# EAGLE design LightFlasher (EAGLE 6.1)
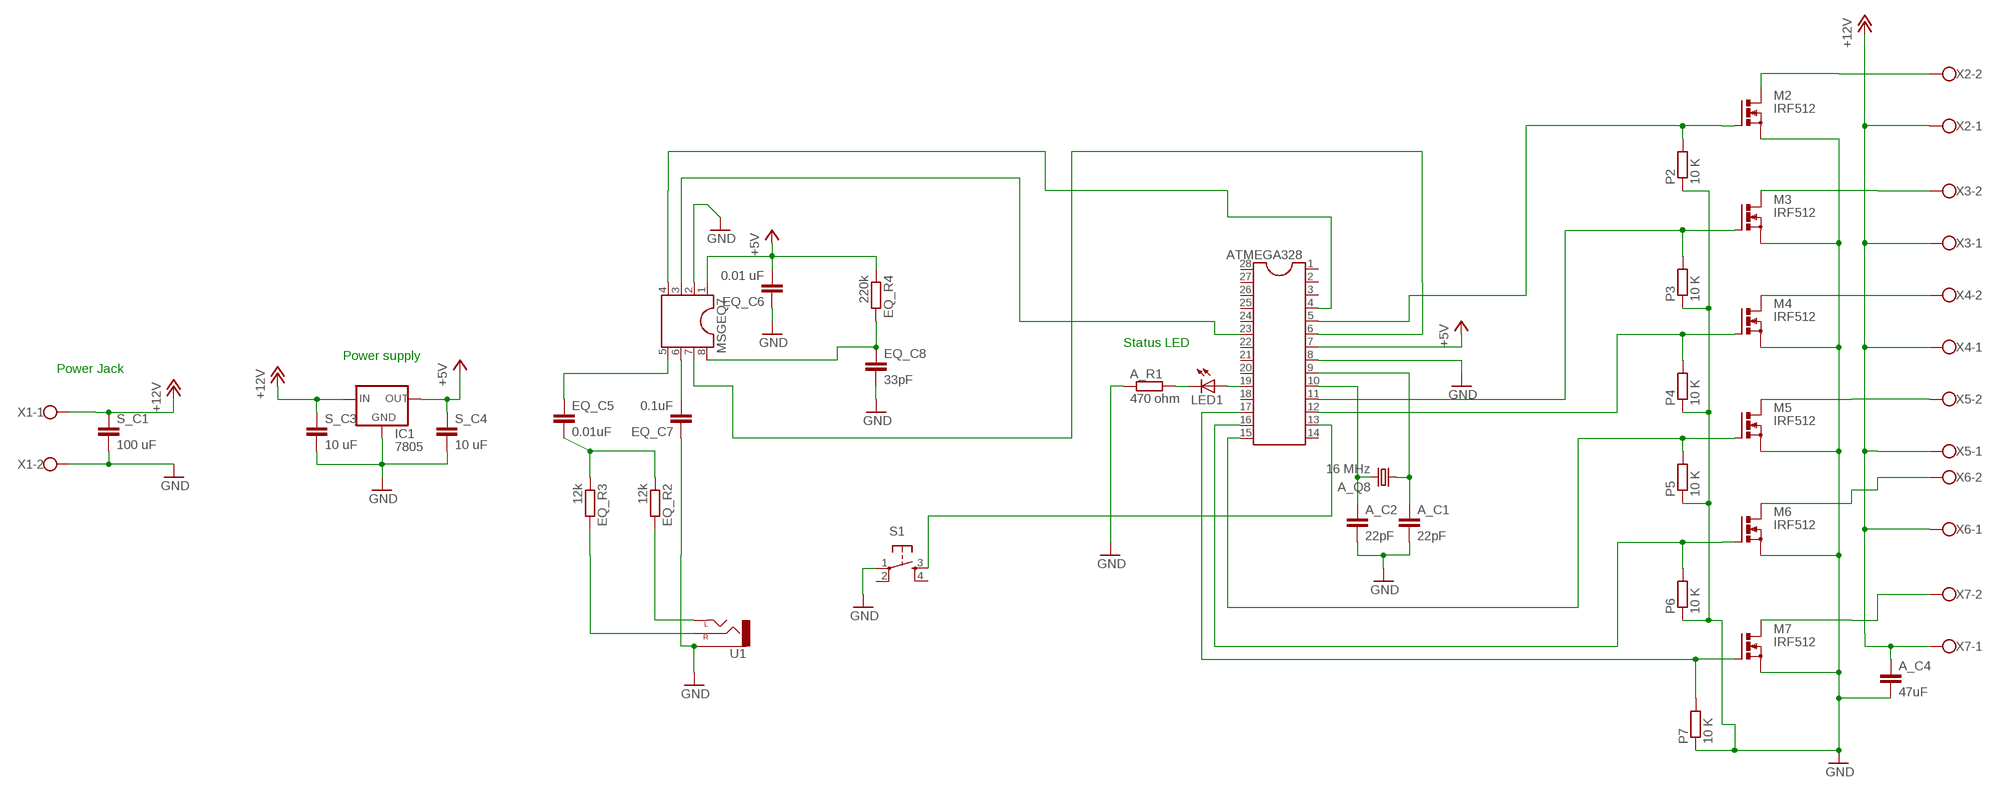
[diagram p0: schematic, sheet 1]

## Parts
A_C1  22pF  C-EU025-024X044  [C025-024X044]
A_C2  22pF  C-EU050-030X075  [C050-030X075]
A_C4  47uF  C-EU025-025X050  [C025-025X050]
A_Q8  16 MHz  CRYSTALHC49S  [HC49/S]
A_R1  470 ohm  R-EU_0204/5  [0204/5]
ATMEGA328  DIL28-3  [DIL28-3]
EQ_C5  0.01uF  C-EU025-024X044  [C025-024X044]
EQ_C6  0.01 uF  C-EU025-024X044  [C025-024X044]
EQ_C7  0.1uF  C-EU025-024X044  [C025-024X044]
EQ_C8  33pF  C-EU025-024X044  [C025-024X044]
EQ_R2  12k  R-EU_0204/5  [0204/5]
EQ_R3  12k  R-EU_0204/5  [0204/5]
EQ_R4  220k  R-EU_0204/5  [0204/5]
IC1  7805  78XXS  [78XXS]
LED1  LED3MM  [LED3MM]
M2  IRF512  [TO220BV]
M3  IRF512  [TO220BV]
M4  IRF512  [TO220BV]
M5  IRF512  [TO220BV]
M6  IRF512  [TO220BV]
M7  IRF512  [TO220BV]
MSGEQ7  DIL8S  [SOCKET-08]
P2  10 K  R-EU_0204/5  [0204/5]
P3  10 K  R-EU_0204/5  [0204/5]
P4  10 K  R-EU_0204/5  [0204/5]
P5  10 K  R-EU_0204/5  [0204/5]
P6  10 K  R-EU_0204/5  [0204/5]
P7  10 K  R-EU_0204/5  [0204/5]
S1  TAC_SWITCHPTH  [TACTILE-PTH]
S_C1  100 uF  C-EU050-025X075  [C050-025X075]
S_C3  10 uF  C-EU025-024X044  [C025-024X044]
S_C4  10 uF  C-EU025-024X044  [C025-024X044]
U1  AUDIO-JACKPTH  [AUDIO-JACK]
X1  W237-102  [W237-102]
X2  W237-102  [W237-102]
X3  W237-102  [W237-102]
X4  W237-102  [W237-102]
X5  W237-102  [W237-102]
X6  W237-102  [W237-102]
X7  W237-102  [W237-102]

## Nets
+5V: ATMEGA328.7 EQ_C6.2 EQ_R4.1 IC1.OUT MSGEQ7.1 S_C4.1
+12V: A_C4.1 IC1.IN S_C1.1 S_C3.1 X1.1 X2.1 X3.1 X4.1 X5.1 X6.1 X7.1
GND: A_C1.2 A_C2.2 A_C4.2 A_R1.1 ATMEGA328.8 EQ_C6.1 EQ_C7.1 EQ_C8.2 IC1.GND M2.S M3.S M4.S M5.S M6.S M7.S MSGEQ7.2 P2.1 P3.1 P4.1 P5.1 P6.1 P7.1 S1.1 S_C1.2 S_C3.2 S_C4.2 U1.SLEEVE X1.2
M6: M6.D X6.2
N$1: A_C2.1 A_Q8.2 ATMEGA328.10
N$2: A_C1.1 A_Q8.1 ATMEGA328.9
N$3: ATMEGA328.19 LED1.A
N$4: A_R1.2 LED1.K(C)
N$5: EQ_R2.2 U1.TIP(LEFT)
N$6: EQ_R3.2 U1.RING(RIGHT)
N$7: ATMEGA328.17 M7.G P7.2
N$8: EQ_C5.1 MSGEQ7.5
N$9: ATMEGA328.16 M6.G P6.2
N$10: ATMEGA328.4 MSGEQ7.4
N$11: EQ_C7.2 MSGEQ7.6
N$12: ATMEGA328.13 S1.3
N$13: EQ_C8.1 EQ_R4.2 MSGEQ7.8
N$14: ATMEGA328.23 MSGEQ7.3
N$15: ATMEGA328.5 M2.G P2.2
N$16: ATMEGA328.11 M3.G P3.2
N$17: ATMEGA328.12 M4.G P4.2
N$18: ATMEGA328.15 M5.G P5.2
N$20: M4.D X4.2
N$21: M2.D X2.2
N$22: M7.D X7.2
N$24: M5.D X5.2
N$26: M3.D X3.2
N$27: EQ_C5.2 EQ_R2.1 EQ_R3.1
N$28: ATMEGA328.6 MSGEQ7.7
Unconnected: ATMEGA328.1 ATMEGA328.2 ATMEGA328.3 ATMEGA328.14 ATMEGA328.18 ATMEGA328.20 ATMEGA328.21 ATMEGA328.22 ATMEGA328.24 ATMEGA328.25 ATMEGA328.26 ATMEGA328.27 ATMEGA328.28 S1.2 S1.4

## Notes on the sheet
- Status LED
- Power supply
- Power Jack

## Library data of the parts
A_C1 A_C2 A_C4 EQ_C5-EQ_C8 S_C1 S_C3 S_C4 = rcl:C-EU: CAPACITOR, European symbol
A_Q8 = crystal:CRYSTAL: CRYSTAL; OC_FARNELL: 1667008; OC_NEWARK: unknown
A_R1 EQ_R2-EQ_R4 P2-P7 = rcl:R-EU_: RESISTOR, European symbol
ATMEGA328 = ic-package:DIL28: Dual In Line
IC1 = v-reg:78XXS: VOLTAGE REGULATOR
LED1 = led:LED: LED OSRAM: - CHIPLED LG R971, LG N971, LY N971, LG Q971, LY Q971, LO R971, LY R971 LH N974, LH R974 LS Q976, LO Q976, LY Q976 LO Q996 - Hyper CHIPLED LW Q18S LB Q993, LB Q99A, LB R99A - SideLED LS A670, LO A670, LY A670, LG A670, LP A670 LB A673, LV A673, LT A673, LW A673 LH A674 LY A675 LS A676, LA A676, LO A676, LY A676, LW A676 LS A679, LY A679, LG A679 - Hyper Micro SIDELED® LS Y876, LA Y876, LO Y876, LY Y876 LT Y87S - SmartLED LW L88C, LW L88S LB L89C, LB L89S, LG L890 LS L89K, LO L89K, LY L89K LS L896, LA L896, LO L896, LY L896 - TOPLED LS T670, LO T670, LY T670, LG T670, LP T670 LSG T670, LSP T670, LSY T670, LOP T670, LYG T670 LG T671, LOG T671, LSG T671 LB T673, LV T673, LT T673, LW T673 LH T674 LS T676, LA T676, LO T676, LY T676, LB T676, LH T676, LSB T676, LW T676 LB T67C, LV T67C, LT T67C, LS T67K, LO T67K, LY T67K, LW E67C LS E67B, LA E67B, LO E67B, LY E67B, LB E67C, LV E67C, LT E67C LW T67C LS T679, LY T679, LG T679 LS T770, LO T770, LY T770, LG T770, LP T770 LB T773, LV T773, LT T773, LW T773 LH T774 LS E675, LA E675, LY E675, LS T675 LS T776, LA T776, LO T776, LY T776, LB T776 LHGB T686 LT T68C, LB T68C - Hyper Mini TOPLED® LB M676 - Mini TOPLED Santana® LG M470 LS M47K, LO M47K, LY M47K Source: http://www.osram.convergy.de LUXEON: - LUMILED® LXK2-PW12-R00, LXK2-PW12-S00, LXK2-PW14-U00, LXK2-PW14-V00 LXK2-PM12-R00, LXK2-PM12-S00, LXK2-PM14-U00 LXK2-PE12-Q00, LXK2-PE12-R00, LXK2-PE12-S00, LXK2-PE14-T00, LXK2-PE14-U00 LXK2-PB12-K00, LXK2-PB12-L00, LXK2-PB12-M00, LXK2-PB14-N00, LXK2-PB14-P00, LXK2-PB14-Q00 LXK2-PR12-L00, LXK2-PR12-M00, LXK2-PR14-Q00, LXK2-PR14-R00 LXK2-PD12-Q00, LXK2-PD12-R00, LXK2-PD12-S00 LXK2-PH12-R00, LXK2-PH12-S00 LXK2-PL12-P00, LXK2-PL12-Q00, LXK2-PL12-R00 Source: www.luxeon.com KINGBRIGHT: KA-3528ASYC Source: www.kingbright.com
M2-M7 = transistor-power:IRF512: N-CHANNEL MOS FET
MSGEQ7 = ic-package:DIL8: Dual In Line / Socket
S1 = SparkFun:TAC_SWITCH: Momentary Switch Button commonly used for reset or general input. Spark Fun Electronics SKU : COM-00097
U1 = SparkFun:AUDIO-JACK: 3.5mm Audio Jack Simple 3.5mm common PCB mount audio jack. SKU: PRT-08032
X1-X7 = con-wago-500:W237-102: WAGO SCREW CLAMP; MPN: 237-102; OC_FARNELL: unknown; OC_NEWARK: 70K9898

## Board
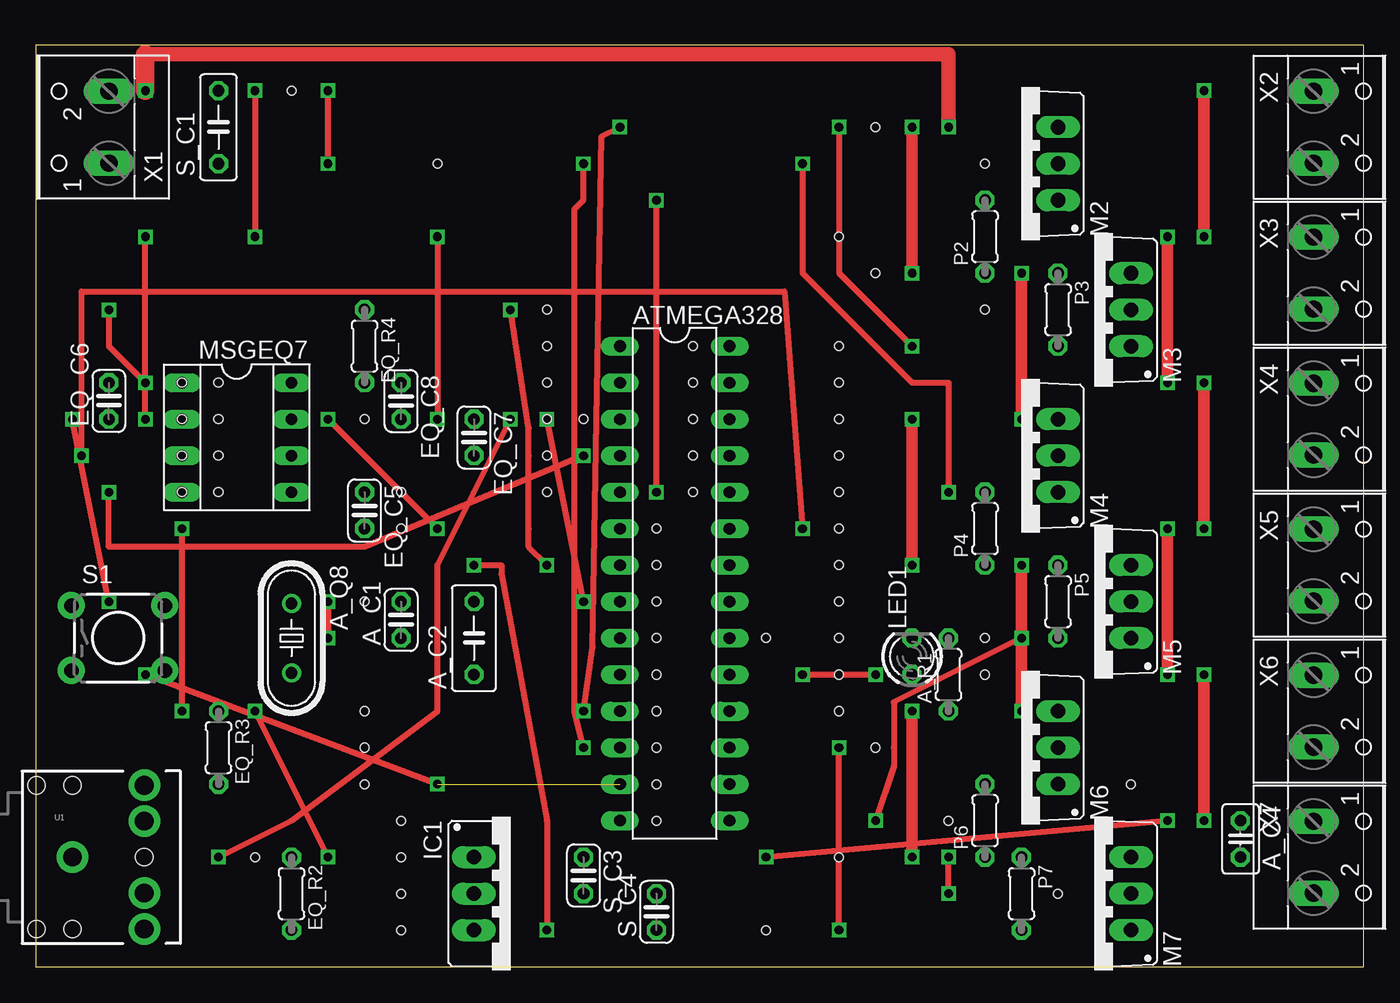
[diagram p1: board, top side]
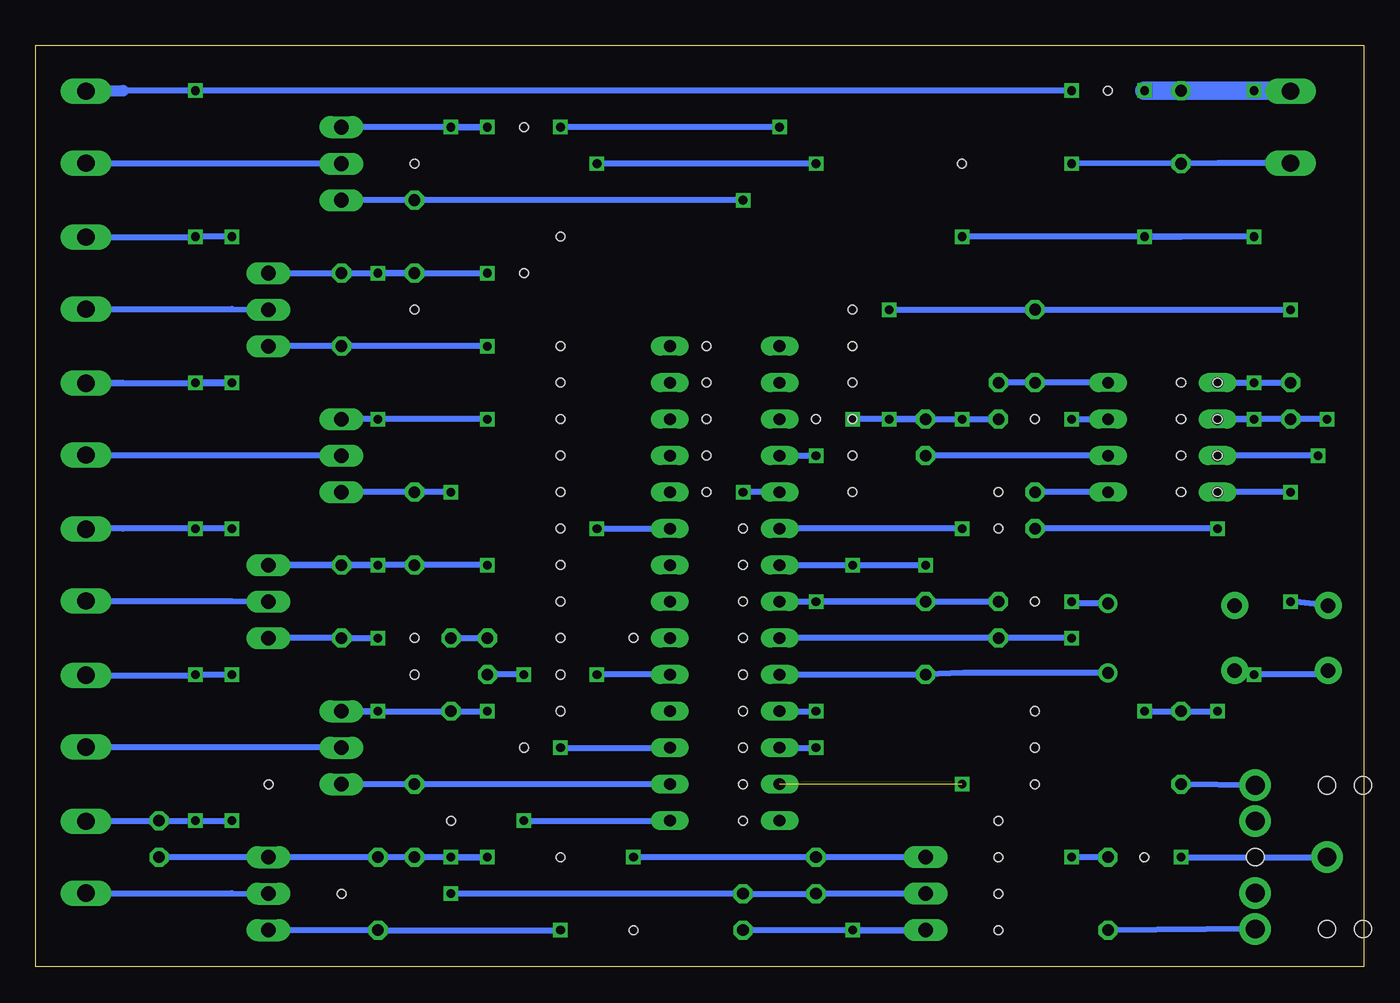
[diagram p2: board, bottom side, seen from below]

Size 92.38 x 64.12 mm. Coordinates in mm from the lower left corner, seen from the top.
Outline: 0,0 92.38,0 92.38,64.12 0,64.12 0,0
Copper layers (1*16): Top 0.035mm / dielectric 1.5mm / Bottom 0.035mm
Design rules: minimum track width 10mil, minimum drill 24mil, track to track 8mil, track to pad 8mil, pad to pad 8mil, via to via 8mil, smd to smd 8mil, copper to edge 40mil, drill to drill 8mil, minimum pad ring 10mil, minimum via ring 8mil, stop-mask expansion 4mil, vias tented up to drill 0mil, thermal gap 10mil
Holes 0.6 mm at 66.04,22.86 58.42,15.24 66.04,45.72 66.04,55.88 71.12,5.08 55.88,25.4 55.88,27.94 58.42,48.26 58.42,58.42 27.94,55.88 22.86,25.4 17.78,60.96 55.88,50.8 35.56,45.72 35.56,38.1 55.88,43.18 55.88,40.64 55.88,38.1 55.88,33.02 43.18,10.16 43.18,12.7 43.18,15.24 43.18,17.78 43.18,20.32 43.18,22.86 43.18,25.4 43.18,27.94 43.18,30.48 45.72,33.02 45.72,35.56 45.72,38.1 45.72,40.64 45.72,43.18 55.88,7.62 50.8,2.54 63.5,10.16 76.2,12.7 55.88,17.78 66.04,20.32 55.88,30.48 55.88,35.56 25.4,2.54 25.4,7.62 22.86,12.7 22.86,17.78 25.4,30.48 10.16,40.64 10.16,38.1 10.16,35.56 10.16,33.02 25.4,33.02 15.24,7.62 25.4,5.08 25.4,10.16 22.86,15.24 38.1,38.1 35.56,35.56 35.56,33.02 35.56,43.18 35.56,40.64 12.7,33.02 12.7,35.56 12.7,38.1 12.7,40.64 22.86,38.1 50.8,22.86 55.88,22.86 55.88,20.32

### Footprints (pad centres in the part's own frame; a part is rotated, then mirrored left to right if it is on the bottom)
C025-024X044 = drill 0.813 octagon: 1 -1.27,0; 2 1.27,0
C050-030X075 = drill 0.813 octagon: 1 -2.54,0; 2 2.54,0
C025-025X050 = drill 0.813 octagon: 1 -1.27,0; 2 1.27,0
HC49/S = drill 0.813: 1 -2.413,0; 2 2.413,0
0204/5 = drill 0.813 octagon: 1 -2.54,0; 2 2.54,0
DIL28-3 = drill 0.813 long: 1 -16.51,-3.81; 2 -13.97,-3.81; 3 -11.43,-3.81; 4 -8.89,-3.81; 5 -6.35,-3.81; 6 -3.81,-3.81; 7 -1.27,-3.81; 8 1.27,-3.81; 9 3.81,-3.81; 10 6.35,-3.81; 11 8.89,-3.81; 12 11.43,-3.81; 13 13.97,-3.81; 14 16.51,-3.81; 15 16.51,3.81; 16 13.97,3.81; 17 11.43,3.81; 18 8.89,3.81; 19 6.35,3.81; 20 3.81,3.81; 21 1.27,3.81; 22 -1.27,3.81; 23 -3.81,3.81; 24 -6.35,3.81; 25 -8.89,3.81; 26 -11.43,3.81; 27 -13.97,3.81; 28 -16.51,3.81
78XXS = drill 1.016 long: GND 0,-2.54; IN -2.54,-2.54; OUT 2.54,-2.54
LED3MM = drill 0.813 octagon: A -1.27,0; K 1.27,0
TO220BV = drill 1.016 long: D 0,-2.54; G -2.54,-2.54; S 2.54,-2.54
SOCKET-08 = drill 0.813 long: 1 -3.81,-3.81; 2 -1.27,-3.81; 3 1.27,-3.81; 4 3.81,-3.81; 5 3.81,3.81; 6 1.27,3.81; 7 -1.27,3.81; 8 -3.81,3.81
TACTILE-PTH = drill 1.016 pad 1.88: 1 -3.251,2.261; 2 3.251,2.261; 3 -3.251,-2.261; 4 3.251,-2.261
C050-025X075 = drill 0.813 octagon: 1 -2.54,0; 2 2.54,0
AUDIO-JACK = drill 1.3 pad 2.184: RING 5,5; RSH 5,2.5; SLEEVE 0,0; TIP 5,-5; TSH 5,-2.5 | hole 1.2: 0,5; -2.5,5; -2.5,-5; 0,-5; 5,0
W237-102 = drill 1.194 long: 1 -2.5,-1.27; 2 2.5,-1.27

### Placement (x,y rotation side)
A_C1  25.4,24.13 90 top
A_C2  30.48,22.86 90 top
A_C4  83.82,8.89 270 top
A_Q8  17.78,22.86 270 top
A_R1  63.5,20.32 90 top
ATMEGA328  44.45,26.67 270 top
EQ_C5  22.86,31.75 270 top
EQ_C6  5.08,39.37 90 top
EQ_C7  30.48,36.83 270 top
EQ_C8  25.4,39.37 270 top
EQ_R2  17.78,5.08 270 top
EQ_R3  12.7,15.24 270 top
EQ_R4  22.86,43.18 270 top
IC1  33.02,5.08 270 top
LED1  60.96,21.59 90 top
M2  68.58,55.88 90 top
M3  73.66,45.72 90 top
M4  68.58,35.56 90 top
M5  73.66,25.4 90 top
M6  68.58,15.24 90 top
M7  73.66,5.08 90 top
MSGEQ7  13.97,36.83 270 top
P2  66.04,50.8 90 top
P3  71.12,45.72 270 top
P4  66.04,30.48 90 top
P5  71.12,25.4 270 top
P6  66.04,10.16 90 top
P7  68.58,5.08 270 top
S1  5.71,22.86 0 top
S_C1  12.7,58.42 90 top
S_C3  38.1,6.35 270 top
S_C4  43.18,3.81 90 top
U1  2.54,7.62 0 top
X1  3.81,58.42 90 top
X2  90.17,58.42 270 top
X3  90.17,48.26 270 top
X4  90.17,38.1 270 top
X5  90.17,27.94 270 top
X6  90.17,17.78 270 top
X7  90.17,7.62 270 top

### Tracks (layer width: path | path; a pad name or v marks a point on that pad's centre or on a via)
+5V  (via drill 0.6)
  Top 0.406: v35.56,27.94 34.29,29.21 34.29,30.48 34.29,35.56 34.29,37.47 v33.02,45.72 | v5.08,45.72 5.08,43.18 v7.62,40.64 | v30.48,27.94 32.38,27.94 32.38,27.3 35.56,10.16 v35.56,2.54
  Bottom 0.406: S_C4.1 IC1.OUT v35.56,2.54 | MSGEQ7.1 v7.62,40.64 | v7.62,40.64 EQ_C6.2 v7.62,40.64 | ATMEGA328.7 v35.56,27.94 v30.48,27.94 | v33.02,45.72 EQ_R4.1 v5.08,45.72
+12V  (via drill 0.6)
  Top 0.406: v20.32,55.88 v20.32,60.96 | v78.74,10.16 v50.8,7.62
  Top 0.813: v81.28,10.16 v81.28,20.32 | v78.74,20.32 v78.74,30.48 | v81.28,30.48 v81.28,40.64 | v78.74,40.64 v78.74,50.8 | v81.28,50.8 v81.28,60.96
  Bottom 0.406: v81.28,10.16 81.32,10.12 X7.1 88.9,10.16 | v78.74,30.48 v81.28,30.48 88.9,30.48 X5.1 86.32,30.48 | X6.1 81.32,20.28 v81.28,20.32 v78.74,20.32 | 86.32,40.64 X4.1 78.78,40.6 | 78.78,40.6 v78.74,40.64 | X3.1 81.32,50.76 v81.28,50.8 v78.74,50.8 78.7,50.84 | X1.1 10.12,55.92 | 10.12,55.92 v20.32,55.88 | v20.32,60.96 76.2,60.96 v81.28,60.96 86.36,60.96 88.9,60.96 X2.1 | IC1.IN S_C3.1 v50.8,7.62 | v81.28,10.16 v78.74,10.16 | 10.12,55.92 S_C1.1 | A_C4.1 v81.28,10.16 | 78.78,40.6 78.74,40.6 v78.74,40.64 | v78.74,40.64 v81.28,40.64
  Bottom 0.813: 86.32,60.96 X2.1
GND  (via drill 0.6)
  Top 0.406: v63.5,5.08 v63.5,7.62 | v38.1,25.4 v35.56,38.1 | v7.62,38.1 v7.62,50.8 | v27.94,50.8 v27.94,38.1 | v15.24,60.96 v15.24,50.8 | v12.7,7.62 17.78,10.16 27.94,17.78 27.94,27.94 30.48,33.02 v33.02,38.1 | v5.08,25.4 v2.54,38.1
  Top 0.813: v60.96,48.26 v60.96,58.42 | v68.58,48.26 v68.58,38.1 | v60.96,38.1 v60.96,27.94 | v68.58,27.94 v68.58,17.78 | v60.96,17.78 v60.96,7.62
  Top 1.016: 7.62,63.5 60.96,63.5 63.5,63.5 v63.5,58.42
  Top 1.27: 7.62,63.5 v7.62,60.96
  Bottom 0.406: P3.1 M3.S P3.1 | P3.1 v68.58,48.26 | v68.58,48.26 P2.1 | P2.1 v60.96,48.26 | v63.5,58.42 v60.96,58.42 v63.5,58.42 | v63.5,58.42 M2.S | P3.1 v68.58,48.26 | M4.S v68.58,38.1 v60.96,38.1 | v60.96,27.94 P4.1 v68.58,27.94 | v68.58,27.94 P5.1 | P5.1 M5.S P5.1 | P5.1 v68.58,27.94 | v68.58,17.78 M6.S A_R1.1 | A_R1.1 v60.96,17.78 A_R1.1 | v63.5,7.62 v60.96,7.62 v63.5,7.62 | v63.5,7.62 P6.1 P7.1 M7.S A_C4.2 | P2.1 v68.58,48.26 | P3.1 v68.58,48.26 | ATMEGA328.8 v38.1,25.4 | v38.1,25.4 A_C2.2 | A_C2.2 A_C1.2 | IC1.GND S_C3.2 S_C4.2 v63.5,5.08 | v7.62,38.1 EQ_C6.1 v2.54,38.1 | v7.62,38.1 MSGEQ7.2 v7.62,38.1 | A_C2.2 v38.1,25.4 | v33.02,38.1 EQ_C7.1 | EQ_C7.1 v27.94,38.1 | v27.94,38.1 EQ_C8.2 v27.94,38.1 | v7.62,50.8 12.7,50.8 | 12.7,50.8 v15.24,50.8 | v15.24,50.8 v27.94,50.8 | v15.24,50.8 12.7,50.8 | v12.7,7.62 U1.SLEEVE | v33.02,38.1 EQ_C7.1 | EQ_C7.1 v33.02,38.1 | v33.02,38.1 v35.56,38.1 | v33.02,38.1 EQ_C7.1 | S1.1 v5.08,25.4 | S_C1.2 v15.24,60.96
  Bottom 1.27: v15.24,60.96 S_C1.2 v7.62,60.96 5.08,60.96 X1.2
M6
  Bottom 0.406: M6.D 71.12,15.28 X6.2 88.9,15.24
N$1
  Bottom 0.406: ATMEGA328.10 A_C2.1 27.81,20.45 A_Q8.2
N$2  (via drill 0.6)
  Top 0.406: v20.32,25.4 v20.32,22.86
  Bottom 0.406: ATMEGA328.9 A_C1.1 v20.32,22.86 | A_Q8.1 20.19,25.27 v20.32,25.4
N$3  (via drill 0.6)
  Top 0.406: v53.34,20.32 v58.42,20.32
  Bottom 0.406: ATMEGA328.19 v53.34,20.32 | v58.42,20.32 LED1.A
N$4
  Bottom 0.406: A_R1.2 LED1.K
N$5
  Bottom 0.406: U1.TIP EQ_R2.2
N$6
  Bottom 0.406: U1.RING EQ_R3.2
N$7  (via drill 0.6)
  Top 0.406: v55.88,2.54 v55.88,15.24
  Bottom 0.406: M7.G P7.2 v55.88,2.54 | v55.88,15.24 ATMEGA328.17
N$8
  Bottom 0.406: MSGEQ7.5 EQ_C5.1
N$9
  Bottom 0.406: M6.G P6.2 ATMEGA328.16
N$10  (via drill 0.6)
  Top 0.406: v38.1,35.56 22.86,29.21 5.08,29.21 v5.08,33.02
  Bottom 0.406: ATMEGA328.4 v38.1,35.56 | v5.08,33.02 MSGEQ7.4
N$11
  Bottom 0.406: MSGEQ7.6 EQ_C7.2
N$12  (via drill 0.6)  (1 unrouted)
  Top 0.406: v27.94,12.7 v7.62,20.32
  Bottom 0.406: S1.3 2.54,20.32 v7.62,20.32
N$13
  Bottom 0.406: MSGEQ7.8 EQ_R4.2 EQ_C8.1
N$14  (via drill 0.6)
  Top 0.406: v3.17,35.56 3.17,46.99 52.07,46.99 v53.34,30.48
  Bottom 0.406: v53.34,30.48 ATMEGA328.23 | v3.17,35.56 MSGEQ7.3
N$15  (via drill 0.6)
  Top 0.406: v43.18,33.02 v43.18,53.34
  Bottom 0.406: M2.G P2.2 v43.18,53.34 | ATMEGA328.5 v43.18,33.02
N$16  (via drill 0.6)
  Top 0.406: v38.1,17.78 38.73,22.23 39.37,57.78 v40.64,58.42 | v55.88,58.42 55.88,48.26 v60.96,43.18
  Bottom 0.406: M3.G P3.2 v60.96,43.18 | ATMEGA328.11 v38.1,17.78 | v40.64,58.42 v55.88,58.42
N$17  (via drill 0.6)
  Top 0.406: v38.1,15.24 37.47,17.78 37.47,52.7 38.1,53.34 38.1,53.98 v38.1,55.88 | v53.34,55.88 53.34,48.26 60.96,40.64 63.5,40.64 63.5,35.56 v63.5,33.02
  Bottom 0.406: M4.G P4.2 v63.5,33.02 | ATMEGA328.12 v38.1,15.24 | v38.1,55.88 v53.34,55.88
N$18  (via drill 0.6)
  Top 0.406: v68.58,22.86 59.69,18.41 59.69,15.24 59.69,13.97 v58.42,10.16
  Bottom 0.406: M5.G P5.2 v68.58,22.86 | v58.42,10.16 ATMEGA328.15
N$20
  Bottom 0.406: X4.2 71.12,35.6 M4.D
N$21
  Bottom 0.406: X2.2 71.16,55.92 M2.D
N$22
  Bottom 0.406: X7.2 78.74,5.12 M7.D
N$24
  Bottom 0.406: X5.2 78.74,25.44 M5.D
N$26
  Bottom 0.406: M3.D 78.74,45.76 X3.2 88.9,45.72
N$27  (via drill 0.6)
  Top 0.406: v10.16,17.78 v10.16,30.48 | v20.32,7.62 v15.24,17.78
  Bottom 0.406: v10.16,17.78 EQ_R3.1 v15.24,17.78 | EQ_R2.1 v20.32,7.62 | v10.16,30.48 EQ_C5.2
N$28  (via drill 0.6)
  Top 0.406: v20.32,38.1 v27.94,30.48
  Bottom 0.406: v27.94,30.48 ATMEGA328.6 | v20.32,38.1 MSGEQ7.7
  other vias: 17.78,38.1